# EAGLE design Micro RC Transmitter (EAGLE 7.6.0)
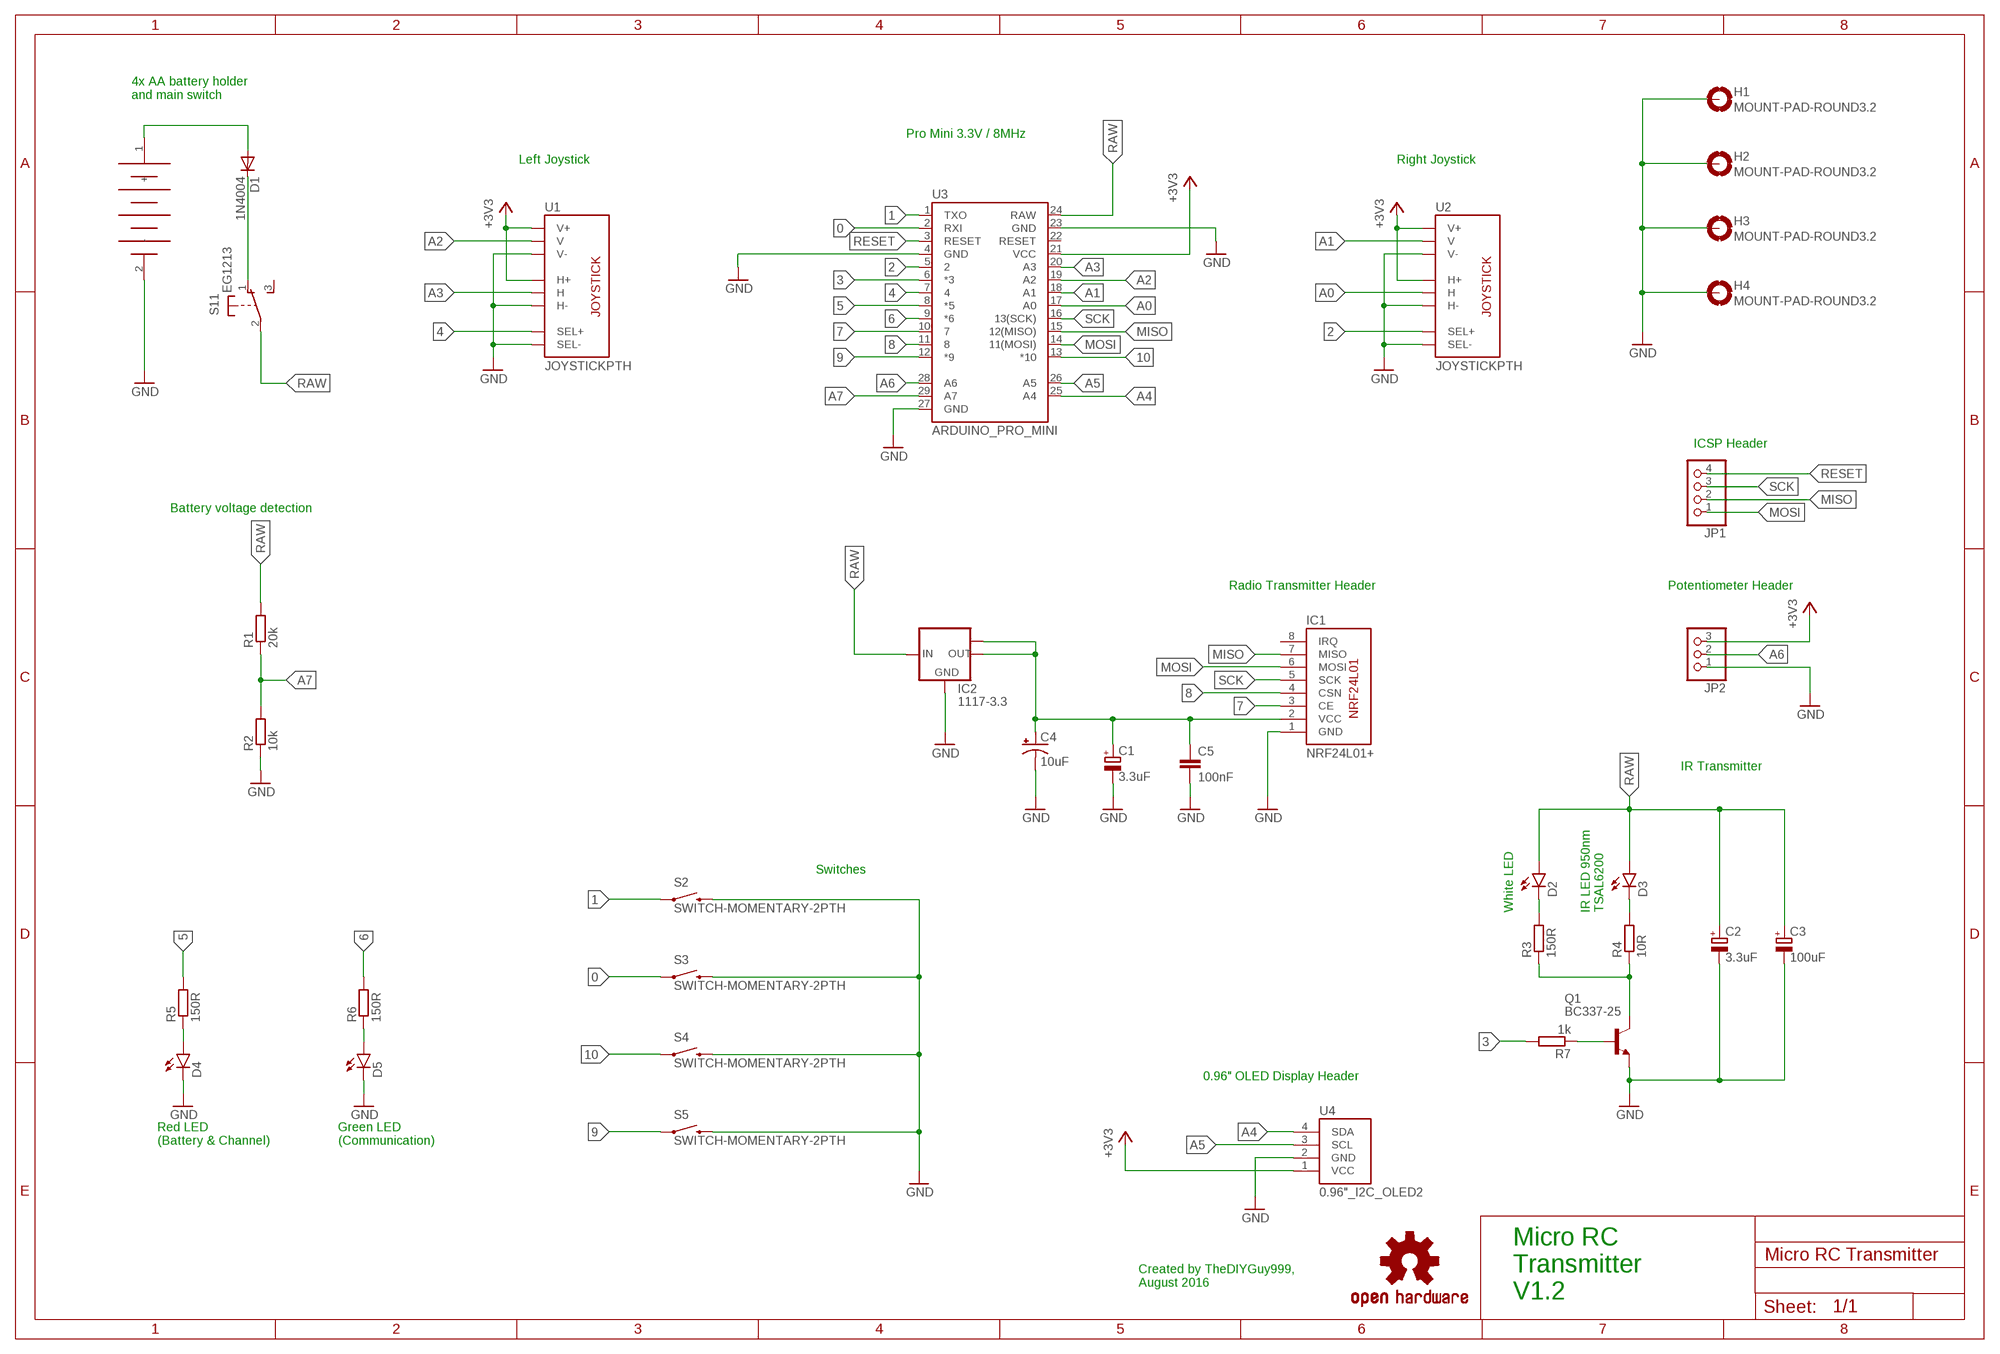
[diagram p0: schematic, sheet 1]

## Parts
C1  3.3uF  CPOL-EUB45181A  [B45181A]
C2  3.3uF  CPOL-EUB45181A  [B45181A]
C3  100uF  CPOL-EUE2.5-7  [E2,5-7]
C4  10uF  10UF-16V-10%(TANT)  [EIA3216]
C5  100nF  C-EUC0805  [C0805]
D1  1N4004  [DO41-10]
D2  LED5MM  [LED5MM]
D3  LED5MM  [LED5MM]
D4  LED3MM  [LED3MM]
D5  LED3MM  [LED3MM]
G1  4X_AA_BATTERY_HOLDER  [4X_AA_BATTERY_HOLDER]
H1  MOUNT-PAD-ROUND3.2  [3,2-PAD]
H2  MOUNT-PAD-ROUND3.2  [3,2-PAD]
H3  MOUNT-PAD-ROUND3.2  [3,2-PAD]
H4  MOUNT-PAD-ROUND3.2  [3,2-PAD]
IC1  NRF24L01+  NRF24L01  [NRF24L01]
IC2  1117-3.3  LM1117MPX-3.3  [SOT223]
JP1  PINHD-1X4  [1X04]
JP2  PINHD-1X3  [1X03]
LOGO1  OSHW-LOGOM  [OSHW-LOGO-M]
Q1  BC337-25  [TO92]
R1  20k  R-EU_0207/10  [0207/10]
R2  10k  R-EU_0207/10  [0207/10]
R3  150R  R-EU_0207/10  [0207/10]
R4  10R  R-EU_0207/10  [0207/10]
R5  150R  R-EU_0207/10  [0207/10]
R6  150R  R-EU_0207/10  [0207/10]
R7  1k  R-EU_0207/10  [0207/10]
S1  EG1213  [EG1213]
S2  SWITCH-MOMENTARY-2PTH  [TACTILE-PTH]
S3  SWITCH-MOMENTARY-2PTH  [TACTILE-PTH]
S4  SWITCH-MOMENTARY-2PTH  [TACTILE-PTH]
S5  SWITCH-MOMENTARY-2PTH  [TACTILE-PTH]
U1  JOYSTICKPTH  [JOYSTICK]
U2  JOYSTICKPTH  [JOYSTICK]
U3  ARDUINO_PRO_MINI  [ARDUINO_PRO_MINI]
U4  0.96"_I2C_OLED2  [0.96"_I2C_OLED_2]

## Nets
0: S3.1 U3.2(RXI)
1: S2.1 U3.1(TXO)
2: U2.B1A(SEL+) U3.5
3: R7.2 U3.6(*3)
4: U1.B1A(SEL+) U3.7
5: R5.2 U3.8(*5)
6: R6.2 U3.9(*6)
7: IC1.3(CE) U3.10
8: IC1.4(CSN) U3.11
9: S5.1 U3.12(*9)
10: S4.1 U3.13(*10)
+3V3: JP2.3 U1.H1(H+) U1.V1(V+) U2.H1(H+) U2.V1(V+) U3.21(VCC) U4.1(VCC)
A0: U2.H2(H) U3.17(A0)
A1: U2.V2(V) U3.18(A1)
A2: U1.V2(V) U3.19(A2)
A3: U1.H2(H) U3.20(A3)
A4: U3.25(A4) U4.4(SDA)
A5: U3.26(A5) U4.3(SCL)
A6: JP2.2 U3.28(A6)
A7: R1.1 R2.2 U3.29(A7)
GND: C1.- C2.- C3.- C4.C(-) C5.2 D4.K(C) D5.K(C) G1.2(-) H1.B3,2(MOUNT) H2.B3,2(MOUNT) H3.B3,2(MOUNT) H4.B3,2(MOUNT) IC1.1(GND) IC2.1(GND) JP2.1 Q1.1(E) R2.1 S2.3 S3.3 S4.3 S5.3 U1.B2A(SEL-) U1.H3(H-) U1.V3(V-) U2.B2A(SEL-) U2.H3(H-) U2.V3(V-) U3.4(GND) U3.23(GND) U3.27(GND) U4.2(GND)
MISO: IC1.7(MISO) JP1.2 U3.15(12(MISO))
MOSI: IC1.6(MOSI) JP1.1 U3.14(11(MOSI))
N$1: D4.A R5.1
N$2: D5.A R6.1
N$3: Q1.3(C) R3.1 R4.1
N$4: D3.K(C) R4.2
N$5: Q1.2(B) R7.1
N$6: D2.K(C) R3.2
N$7: D1.A G1.1(+)
N$8: D1.C S1.1(1:O)
N$9: C1.+ C4.A(+) C5.1 IC1.2(VCC) IC2.2(OUT) IC2.TAB(OUT1)
RAW: C2.+ C3.+ D2.A D3.A IC2.3(IN) R1.2 S1.2(1:P) U3.24(RAW)
RESET: JP1.4 U3.3(RESET)
SCK: IC1.5(SCK) JP1.3 U3.16(13(SCK))
Unconnected: IC1.8(IRQ) S1.3(1:S) S1.MT1(MT) S1.MT2(MT) U3.22(RESET)

## Notes on the sheet
- 4x AA battery holder
  and main switch
- Pro Mini 3.3V / 8MHz
- Left Joystick | Right Joystick
- ICSP Header
- Battery voltage detection
- Radio Transmitter Header | Potentiometer Header
- IR Transmitter
- Switches
- White LED
- IR LED 950nm
  TSAL6200
- 0.96" OLED Display Header
- Red LED
  (Battery & Channel)
- Green LED
  (Communication)
- Created by TheDIYGuy999,
  August 2016
- Micro RC
  Transmitter
  V1.2

## Library data of the parts
C1-C3 = rcl:CPOL-EU: POLARIZED CAPACITOR, European symbol
C4 = SparkFun-Capacitors:10UF-16V-10%(TANT): CAP-00811 1206/EIA-3216 Tantalum capacitor; PROD_ID: CAP-00811
C5 = rcl:C-EU: CAPACITOR, European symbol
D1 = diode:1N4004: DIODE general purpose rectifier, 1 A
D2 D3 = SparkFun-LED:LED: LEDs Standard schematic elements and footprints for 5mm, 3mm, 1206, and 0603 sized LEDs. 5mm - Spark Fun Electronics SKU : COM-00529 (and others)
D4 D5 = SparkFun-LED:LED: LEDs Standard schematic elements and footprints for 5mm, 3mm, 1206, and 0603 sized LEDs. 5mm - Spark Fun Electronics SKU : COM-00529 (and others); PROD_ID: DIO-08794
G1 = 00_custom:4X_AA_BATTERY_HOLDER: http://www.ebay.ch/itm/401053643951?_trksid=p2060353.m2749.l2649&ssPageName=STRK%3AMEBIDX%3AIT
H1-H4 = holes:MOUNT-PAD-ROUND: MOUNTING PAD, round
IC1 = 00_custom:NRF24L01: 2.4GHz Radio Module
IC2 = lm1117:LM1117MPX-*
JP1 = 00_custom_pinhead:PINHD-1X4: PIN HEADER
JP2 = 00_custom_pinhead:PINHD-1X3: PIN HEADER
LOGO1 = SparkFun-Aesthetics:OSHW-LOGO: Open Source Hardware Logo This logo indicates the piece of hardware it is found on incorporates a OSHW license and/or adheres to the definition of open source hardware found here: http://freedomdefined.org/OSHW
Q1 = transistor-npn:BC337*: NPN Transistor
R1-R7 = rcl:R-EU_: RESISTOR, European symbol
S1 = adafruit:EG1213: E-Switch right-angle slide SPDT Part #EG1213 http://www.ladyada.net/library/eagle
S2-S5 = SparkFun-Electromechanical:SWITCH-MOMENTARY-2: Various NO switches- pushbuttons, reed, etc; PROD_ID: SWCH-08441
U1 U2 = SparkFun-Electromechanical:JOYSTICK: Thumb Joystick Joystick commonly found in PS2 controllers. Two pots and a select switch. Footprint proven. Spark Fun Electronics SKU : COM-09032
U3 = 00_custom:ARDUINO_PRO_MINI
U4 = 00_custom:0.96"_I2C_OLED: http://www.ebay.ch/itm/White-0-96-I2C-IIC-Serial-128X64-OLED-LCD-LED-Display-Module-Arduino-/141676867755?

## Board
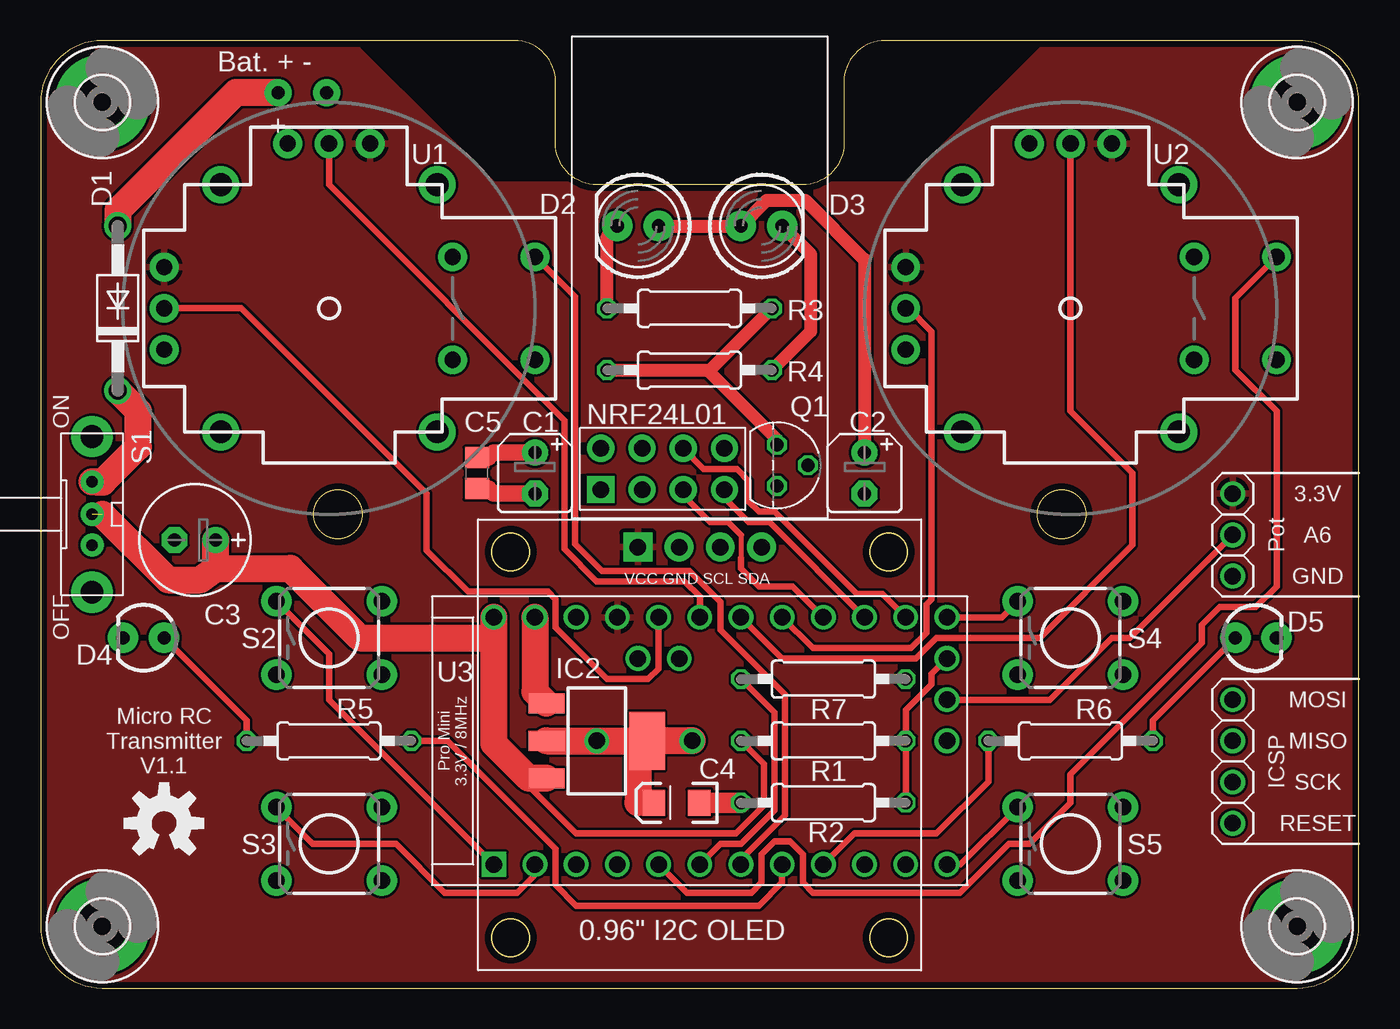
[diagram p1: board, top side]
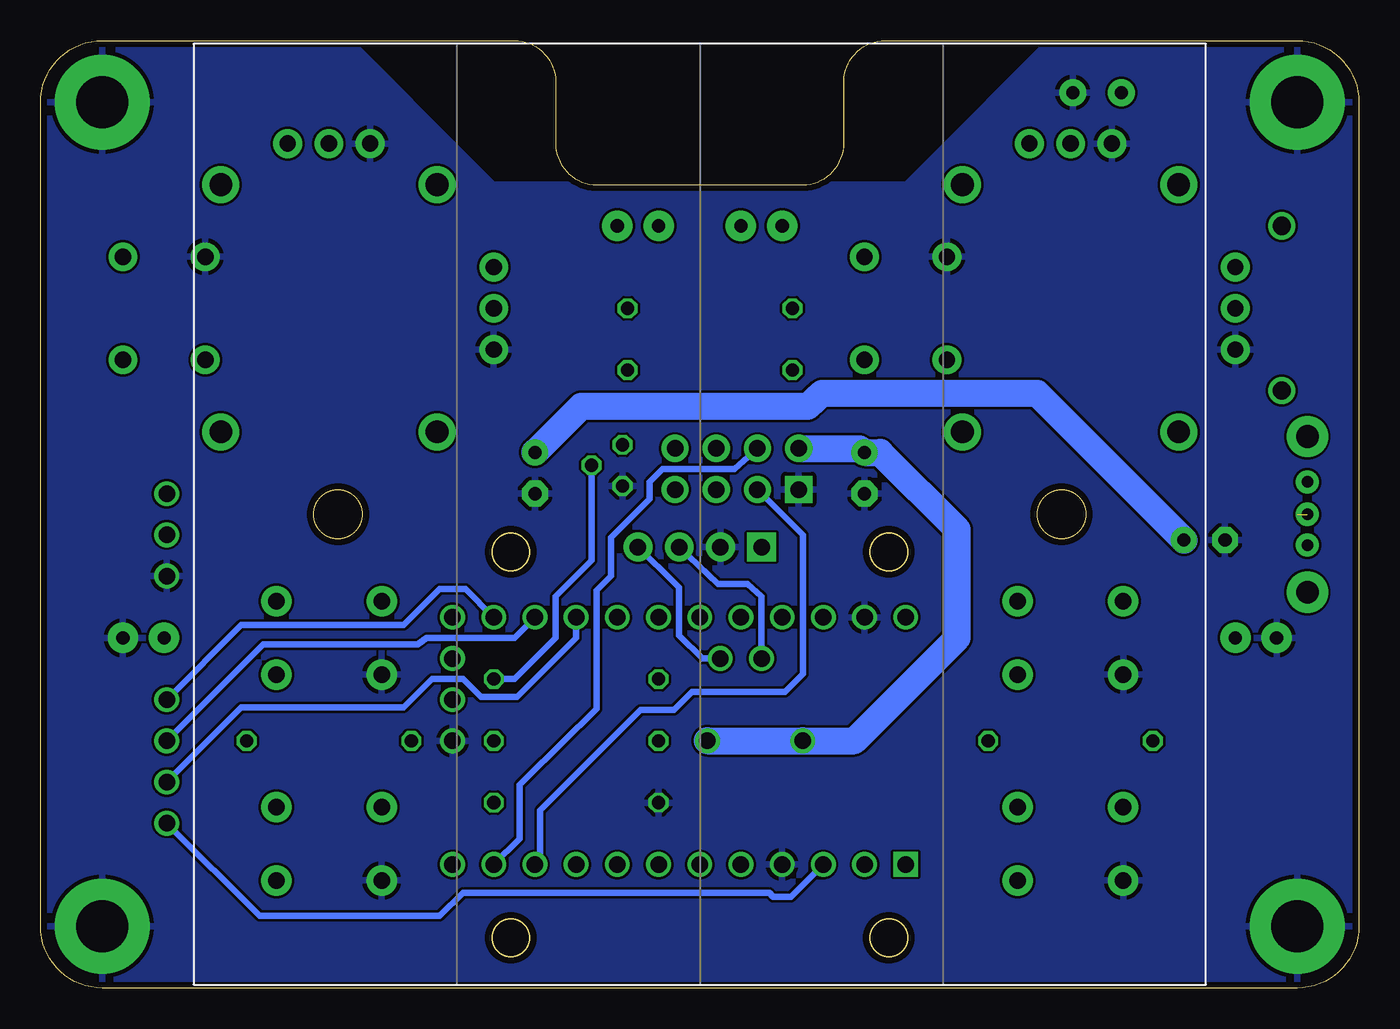
[diagram p2: board, bottom side, seen from below]

Size 81.28 x 58.42 mm. Coordinates in mm from the lower left corner, seen from the top.
Outline: 0,54.61 0,3.81 arc90 3.81,0 77.47,0 arc90 81.28,3.81 81.28,54.61 arc90 77.47,58.42 52.07,58.42 arc90 49.53,55.88 49.53,52.07 arc-90 46.99,49.53 34.29,49.53 arc-90 31.75,52.07 31.75,55.88 arc90 29.21,58.42 3.81,58.42 arc90 0,54.61
Copper layers (1*16): Top 0.0356mm / dielectric 1.5011mm / Bottom 0.0356mm
Design rules "OSHPark_LaenPCBOrder": minimum track width 6mil, minimum drill 13mil, track to track 6mil, track to pad 6mil, pad to pad 6mil, via to via 6mil, smd to smd 6mil, copper to edge 15mil, drill to drill 6mil, minimum pad ring 7mil, minimum via ring 7mil, stop-mask expansion 3mil, vias tented up to drill 0mil, thermal gap 10mil

### Footprints (pad centres in the part's own frame; a part is rotated, then mirrored left to right if it is on the bottom)
B45181A = drill 0.813 pad 1.6: + -1.27,0 | drill 0.813 pad 1.6 octagon: - 1.27,0
E2,5-7 = drill 0.813 pad 1.6: + -1.27,0 | drill 0.813 pad 1.6 octagon: - 1.27,0
EIA3216 = smd 1.4 x 1.6: A 1.4,0; C -1.4,0
C0805 = smd 1.3 x 1.5: 1 -0.95,0; 2 0.95,0
DO41-10 = drill 1.118: A 5.08,0; C -5.08,0
LED5MM = drill 0.813 pad 1.88: A -1.27,0; K 1.27,0
LED3MM = drill 0.813 pad 1.88: A -1.27,0; K 1.27,0
4X_AA_BATTERY_HOLDER = drill 0.8 pad 1.676: 1 26,26; 2 23,26
3,2-PAD = drill 3.2 pad 5.842: B3,2 0,0
NRF24L01 = drill 1.016 pad 1.676 square: 1 -1.27,1.27 | drill 1.016 pad 1.676: 2 -3.81,1.27; 3 -1.27,3.81; 4 -3.81,3.81; 5 -1.27,6.35; 6 -3.81,6.35; 7 -1.27,8.89; 8 -3.81,8.89
SOT223 = smd 1.219 x 2.235: 1 -2.311,-3.099; 2 0,-3.099; 3 2.311,-3.099 | smd 3.6 x 2.2: TAB 0,3.099
1X04 = drill 1.016: 1 -3.81,0; 2 -1.27,0; 3 1.27,0; 4 3.81,0
1X03 = drill 1.016: 1 -2.54,0; 2 0,0; 3 2.54,0
TO92 = drill 0.813 octagon: 1 1.27,0; 2 0,1.905; 3 -1.27,0
0207/10 = drill 0.813 octagon: 1 -5.08,0; 2 5.08,0
EG1213 = drill 0.7 pad 1.422: 1 -2,0; 2 0,0; 3 1.9,0 | drill 1.4 pad 2.54: MT1 -4.8,0; MT2 4.8,0
TACTILE-PTH = drill 1.016 pad 1.88: 1 -3.251,2.261; 2 3.251,2.261; 3 -3.251,-2.261; 4 3.251,-2.261
JOYSTICK = drill 1 pad 1.778: B1A -3.175,12.7; B1B 3.175,12.7; B2A -3.175,7.62; B2B 3.175,7.62; H1 -2.54,-10.16; H2 0,-10.16; H3 2.54,-10.16; V1 -10.16,2.54; V2 -10.16,0; V3 -10.16,-2.54 | drill 1.397 pad 2.286: MOUNT1 -7.62,6.668; MOUNT2 -7.62,-6.668; MOUNT3 7.62,-6.668; MOUNT4 7.62,6.668
ARDUINO_PRO_MINI = drill 1.016 square: 1 -7.62,12.7 | drill 1.016: 2 -7.62,10.16; 3 -7.62,7.62; 4 -7.62,5.08; 5 -7.62,2.54; 6 -7.62,0; 7 -7.62,-2.54; 8 -7.62,-5.08; 9 -7.62,-7.62; 10 -7.62,-10.16; 11 -7.62,-12.7; 12 -7.62,-15.24; 13 7.62,-15.24; 14 7.62,-12.7; 15 7.62,-10.16; 16 7.62,-7.62; 17 7.62,-5.08; 18 7.62,-2.54; 19 7.62,0; 20 7.62,2.54; 21 7.62,5.08; 22 7.62,7.62; 23 7.62,10.16; 24 7.62,12.7; 25 5.08,1.27; 26 5.08,3.81; 27 0,-15.24; 28 2.54,-15.24; 29 5.08,-15.24
0.96"_I2C_OLED_2 = drill 1.016 pad 1.778 square: 1 9.84,-1.7 | drill 1.016 pad 1.778: 2 12.38,-1.7; 3 14.92,-1.7; 4 17.46,-1.7

### Placement (x,y rotation side)
C1  30.48,31.75 270 top
C2  50.8,31.75 270 top
C3  9.53,27.62 180 top
C4  39.21,11.43 180 top
C5  26.91,31.75 270 top
D1  4.76,41.91 90 top
D2  36.83,46.99 180 top
D3  44.45,46.99 0 top
D4  6.35,21.59 180 top
D5  74.93,21.59 0 top
G1  40.64,29.21 0 bottom
H1  3.81,54.61 0 top
H2  3.81,3.81 0 top
H3  77.47,54.61 0 top
H4  77.47,3.81 0 top
IC1  33.27,29.46 270 top
IC2  34.29,15.24 270 top
JP1  73.5,13.97 270 top
JP2  73.5,27.94 90 top
LOGO1  7.62,10.16 0 top
Q1  45.4,32.23 270 top
R1  48.26,15.24 180 top
R2  48.26,11.43 0 top
R3  40.01,41.91 180 top
R4  40.01,38.1 0 top
R5  17.78,15.24 0 top
R6  63.5,15.24 180 top
R7  48.26,19.05 180 top
S1  3.17,29.21 270 top
S2  17.78,21.59 0 top
S3  17.78,8.89 0 top
S4  63.5,21.59 0 top
S5  63.5,8.89 0 top
U1  17.78,41.91 270 top
U2  63.5,41.91 270 top
U3  40.64,15.24 90 top
U4  26.99,28.89 0 top

### Tracks (layer width: path | path; a pad name or v marks a point on that pad's centre or on a via)
0
  Top 0.406: U3.2 30.48,6.99 29.37,5.87 24.92,5.87 21.91,8.89 16.79,8.89 S3.1
1
  Top 0.406: U3.1 17.78,17.78 17.78,20.6 S2.1
2
  Top 0.406: U3.5 39.85,5.87 43.81,5.87 44.45,6.51 44.45,8.26 45.24,9.05 46.2,9.05 46.99,8.26 46.99,6.51 47.62,5.87 56.67,5.87 59.69,8.89 60.96,8.89 63.5,11.43 63.5,13.18 71.6,21.27 71.6,22.38 72.71,23.5 74.93,23.5 76.2,24.77 76.2,35.56 73.66,38.1 73.66,42.55 U2.B1A
3
  Top 0.406: U3.6 41.91,8.89 43.18,8.89 45.24,10.95 45.24,16.99 R7.2
4
  Top 0.406: U3.7 43.18,7.94 45.88,10.64 45.88,18.1 41.91,22.07 41.91,23.81 40.01,25.72 34.61,25.72 32.94,27.38 32.94,42.62 U1.B1A
5
  Top 0.406: R5.2 25.08,15.24 31.75,8.57 31.75,6.35 33.02,5.08 44.29,5.08 45.72,6.51 U3.8
6
  Top 0.406: U3.9 50.16,9.53 55.24,9.53 58.42,12.7 R6.2
7
  Bottom 0.406: U3.10 50.48,7.94 50.48,10.95 44.29,17.14 42.23,17.14 41.12,18.26 35.4,18.26 34.29,19.37 34.29,27.94 IC1.3
8
  Bottom 0.406: U3.11 51.75,9.21 51.75,12.54 51.36,12.94 46.99,17.22 46.99,24.53 46.12,25.4 46.12,27.78 43.74,30.16 43.74,31.19 42.94,31.99 38.5,31.99 IC1.4
9
  Top 0.406: U3.12 56.72,7.62 S5.1
10
  Top 0.406: U3.13 59.26,22.86 S4.1
+3V3
  pour Top: -2.54,-2.54 -2.54,60.96 16.51,60.96 27.94,49.53 53.34,49.53 64.77,60.96 83.82,60.96 83.82,-2.54
A0
  Top 0.406: U2.H2 53.5,41.91 54.93,40.48 54.93,23.97 54.61,23.65 54.61,21.91 53.66,20.95 47.62,20.95 U3.17
A1
  Top 0.406: U2.V2 63.5,35.56 67.31,31.75 67.31,27.3 61.59,21.59 55.24,21.59 53.98,20.32 45.72,20.32 U3.18
A2
  Top 0.406: U1.V2 17.78,49.53 32.31,35 32.31,27.07 34.29,25.08 39.69,25.08 40.64,24.13 U3.19
A3
  Top 0.406: U1.H2 12.38,41.91 23.81,30.48 23.81,26.99 26.35,24.45 31.27,24.45 31.75,23.97 31.75,22.23 34.92,19.05 37.47,19.05 38.1,19.68 U3.20
A4
  Bottom 0.406: U3.25 40.48,20.32 41.91,21.75 41.91,24.68 42.15,24.92 U4.4
A5
  Bottom 0.406: U3.26 36.83,24.13 37.7,24.92 39.53,24.92 U4.3
A6
  Top 0.406: JP2.2 67.15,21.59 66.04,21.59 62.23,17.78 U3.28
A7
  Top 0.406: U3.29 54.93,19.37 54.93,18.73 53.34,17.14 R1.1 R2.2
GND
  Top 1.016: C5.2 27.62,30.8 27.94,30.48 C1.-
  Top 1.27: C4.C R2.1
  Top 1.676: U3.23 30.48,18.26 IC2.1
  pour Bottom: -1.27,-1.27 -1.27,59.69 17.78,59.69 27.94,49.53 53.34,49.53 63.5,59.69 82.55,59.69 82.55,-1.27
MISO
  Top 0.406: IC1.7 42.23,30.73 42.23,30.16 43.66,28.73 44.93,28.73 U3.15
  Bottom 0.406: U3.15 52.07,21.59 57.47,21.59 58.02,21.19 67.55,21.19 JP1.2
MOSI
  Top 0.406: IC1.6 40.88,31.99 42.94,31.99 43.66,31.27 43.66,30 44.29,29.37 45.24,29.37 50.32,24.29 51.91,24.29 U3.14
  Bottom 0.406: JP1.1 68.9,22.38 58.9,22.38 56.67,24.61 55.09,24.61 U3.14
N$1
  Top 0.406: R5.1 12.7,16.51 D4.A
N$2
  Top 0.406: R6.1 68.58,16.51 D5.A
N$3
  Top 0.406: 41.12,38.1 41.27,38.1
  Top 0.813: R4.1 41.12,38.1 45.4,33.81 Q1.3 | 41.27,38.1 R3.1
N$4
  Top 0.813: D3.K 47.47,45.24 47.47,40.48 R4.2
N$5
  Bottom 0.406: Q1.2 47.31,26.35 49.53,24.13 49.53,21.59 52.07,19.05 R7.1
N$6
  Top 0.813: R3.2 34.92,46.35 D2.K
N$7
  Top 1.676: G1.1 12.03,55.21 4.76,47.94 D1.A
N$8
  Top 1.676: S1.1 3.51,31.19 3.84,31.19 6.03,33.38 6.03,35.56 D1.C
N$9  (via drill 1.02)
  Top 1.016: 36.83,11.43 C4.A | C5.1 27.62,32.7 27.94,33.02 C1.+
  Top 1.676: IC2.2 IC2.TAB | v40.16,15.24 IC2.TAB | IC2.TAB 36.83,15.24 36.83,11.43
  Bottom 1.676: v40.16,15.24 v34.29,15.24 31.11,15.24 24.77,21.59 24.77,28.26 29.53,33.02 C1.+ 30.8,33.26 IC1.2
RAW  (1 unrouted)
  Top 0.406: 27.62,14.92 33.02,9.53 42.86,9.53 44.61,11.27 44.61,13.81 R1.2
  Top 0.813: D2.A D3.A 44.77,48.58 47.15,48.58 50.8,44.93 C2.+ | 27.94,15.08 27.62,14.92
  Top 1.676: 10.81,27.61 C3.+ 10.79,25.88 | 3.81,29.21 7.86,25.16 9.84,25.16 10.79,25.88 | 10.79,25.88 15.4,25.88 19.68,21.59 27.94,21.59 | U3.24 27.94,21.59 | 27.94,21.59 27.94,15.08 30.09,12.93 IC2.3
  Bottom 1.676: C2.+ 47.94,35.88 33.97,35.88 33.1,36.67 19.84,36.67 C3.+
RESET
  Bottom 0.406: U3.3 35,5.64 36.12,5.64 36.35,5.87 55.24,5.87 56.67,4.45 67.79,4.45 JP1.4
SCK
  Top 0.305: 43.18,27.94 43.18,26.51
  Top 0.406: IC1.5 39.61,30.4 41.27,28.73 42.39,28.73 43.18,27.94 | 43.18,26.51 43.18,25.88 44.29,24.77 46.35,24.77 U3.16
  Bottom 0.406: JP1.3 68.9,17.3 58.9,17.3 57.15,19.05 55.24,19.05 54.13,17.94 51.91,17.94 48.26,21.59 U3.16

### Text on the board
tNames: Bat. + - | ON | NRF24L01 | 3.3V | Pot | A6 | GND | OFF | MOSI | Micro RC / Transmitter / V1.1 | Pro Mini / 3.3V / 8MHz | MISO | ICSP | SCK | RESET